# Altium schematic sheet Communication.SchDoc
size A
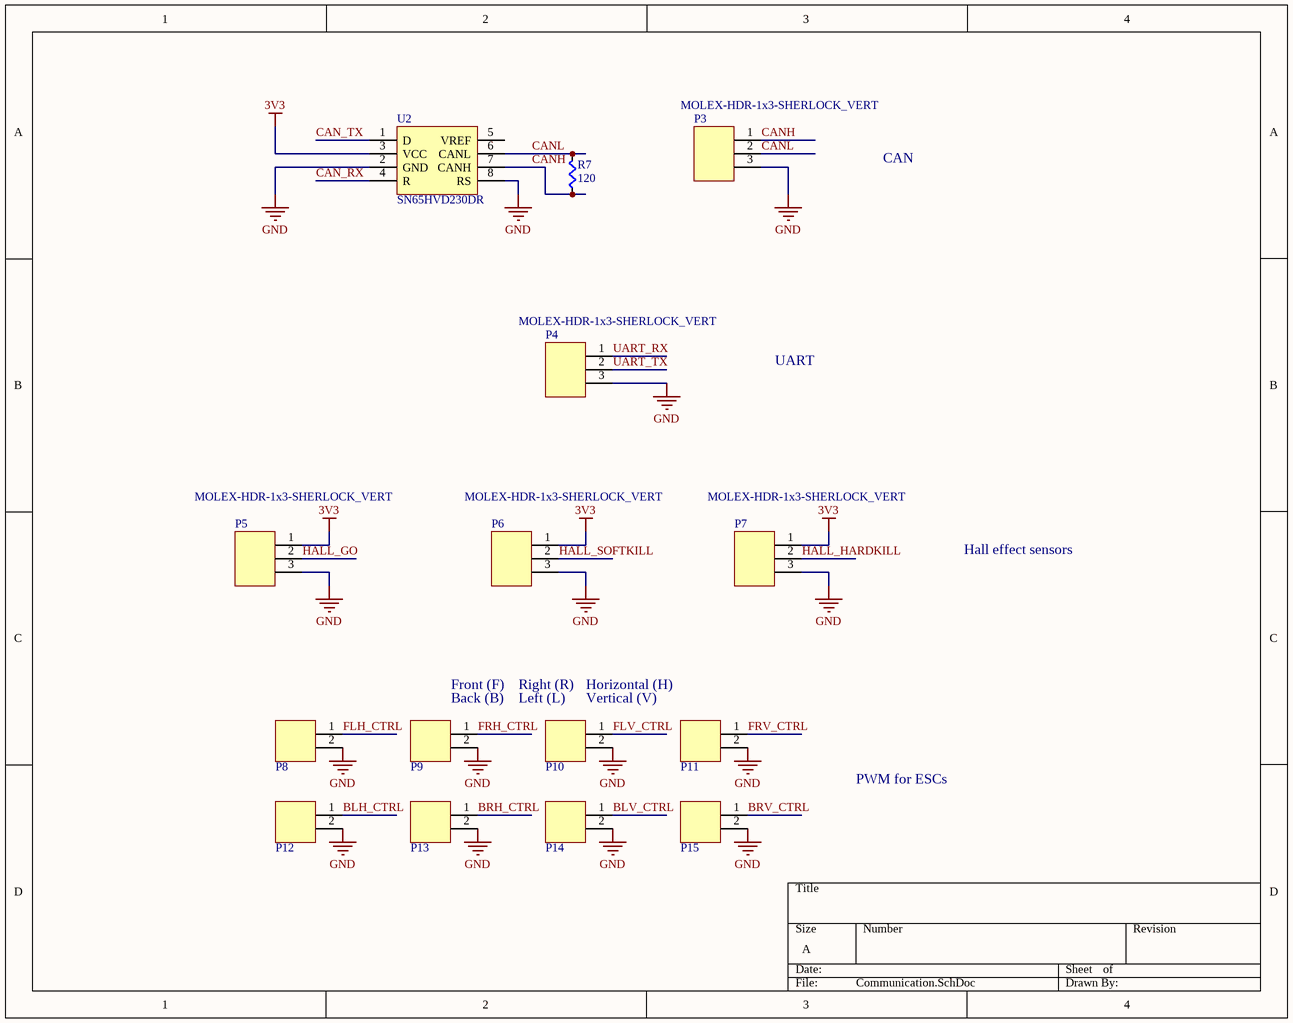
[diagram p0: Communication.SchDoc]

## Parts
P3  MOLEX-HDR-1x3-SHERLOCK_VERT  [MOLEX-HDR-1X3-SHERLOCK-VERT]
P4  MOLEX-HDR-1x3-SHERLOCK_VERT  [MOLEX-HDR-1X3-SHERLOCK-VERT]
P5  MOLEX-HDR-1x3-SHERLOCK_VERT  [MOLEX-HDR-1X3-SHERLOCK-VERT]
P6  MOLEX-HDR-1x3-SHERLOCK_VERT  [MOLEX-HDR-1X3-SHERLOCK-VERT]
P7  MOLEX-HDR-1x3-SHERLOCK_VERT  [MOLEX-HDR-1X3-SHERLOCK-VERT]
P8  2-pin Vert Sherlock  [MOLEX-HDR-1X2-SHERLOCK-VERT]  (value not drawn)
P9  2-pin Vert Sherlock  [MOLEX-HDR-1X2-SHERLOCK-VERT]  (value not drawn)
P10  2-pin Vert Sherlock  [MOLEX-HDR-1X2-SHERLOCK-VERT]  (value not drawn)
P11  2-pin Vert Sherlock  [MOLEX-HDR-1X2-SHERLOCK-VERT]  (value not drawn)
P12  2-pin Vert Sherlock  [MOLEX-HDR-1X2-SHERLOCK-VERT]  (value not drawn)
P13  2-pin Vert Sherlock  [MOLEX-HDR-1X2-SHERLOCK-VERT]  (value not drawn)
P14  2-pin Vert Sherlock  [MOLEX-HDR-1X2-SHERLOCK-VERT]  (value not drawn)
P15  2-pin Vert Sherlock  [MOLEX-HDR-1X2-SHERLOCK-VERT]  (value not drawn)
R7  value 120  [RES0603]  (hidden comment: Res)
U2  SN65HVD230DR  [SOIC-8pin]

## Nets
3V3: P5.1 P6.1 P7.1 U2.3(VCC)
GND: P3.3 P4.3 P5.3 P6.3 P7.3 P8.2 P9.2 P10.2 P11.2 P12.2 P13.2 P14.2 P15.2 U2.2(GND) U2.8(RS)
BLH_CTRL: P12.1
BLV_CTRL: P14.1
BRH_CTRL: P13.1
BRV_CTRL: P15.1
CAN_RX: U2.4(R)
CAN_TX: U2.1(D)
CANH: P3.1 R7.2(B) U2.7(CANH)
CANL: P3.2 R7.1(A) U2.6(CANL)
FLH_CTRL: P8.1
FLV_CTRL: P10.1
FRH_CTRL: P9.1
FRV_CTRL: P11.1
HALL_GO: P5.2
HALL_HARDKILL: P7.2
HALL_SOFTKILL: P6.2
UART_RX: P4.1
UART_TX: P4.2

Not connected (* = marked no-connect by the designer): U2 5(VREF)

## Notes on the sheet
- CAN
- UART
- Hall effect sensors
- (near P9) Front (F)
- (near P9) Back (B)
- (near P10) Right (R)
- (near P10) Left (L)
- Horizontal (H)
- (near P10) Vertical (V)
- PWM for ESCs

## Library data of the parts
P3-P7 = MOLEX-HDR-1x3-SHERLOCK_VERT: Header, Molex, 2mm Pitch Sherlock Header, Single Row, Vertical, 3 Circuits, Length 3.3mm, 0353620376; Manufacturer Part Number: *; Order Part Number: *
P8-P15 = MOLEX-HDR-1x2-SHERLOCK_VERT: Header, Molex, 2mm Pitch Sherlock Header, Single Row, Vertical, 2 Circuits, Length 3.3mm, 0353620250; Manufacturer Part Number: *; Order Part Number: *
U2 = SN65HVD230DR: 3.3V CAN Bus Transciever
R7 = Res: Supplier 1: Digi-Key